# EAGLE design SMART4RGB (EAGLE 9.6.2)
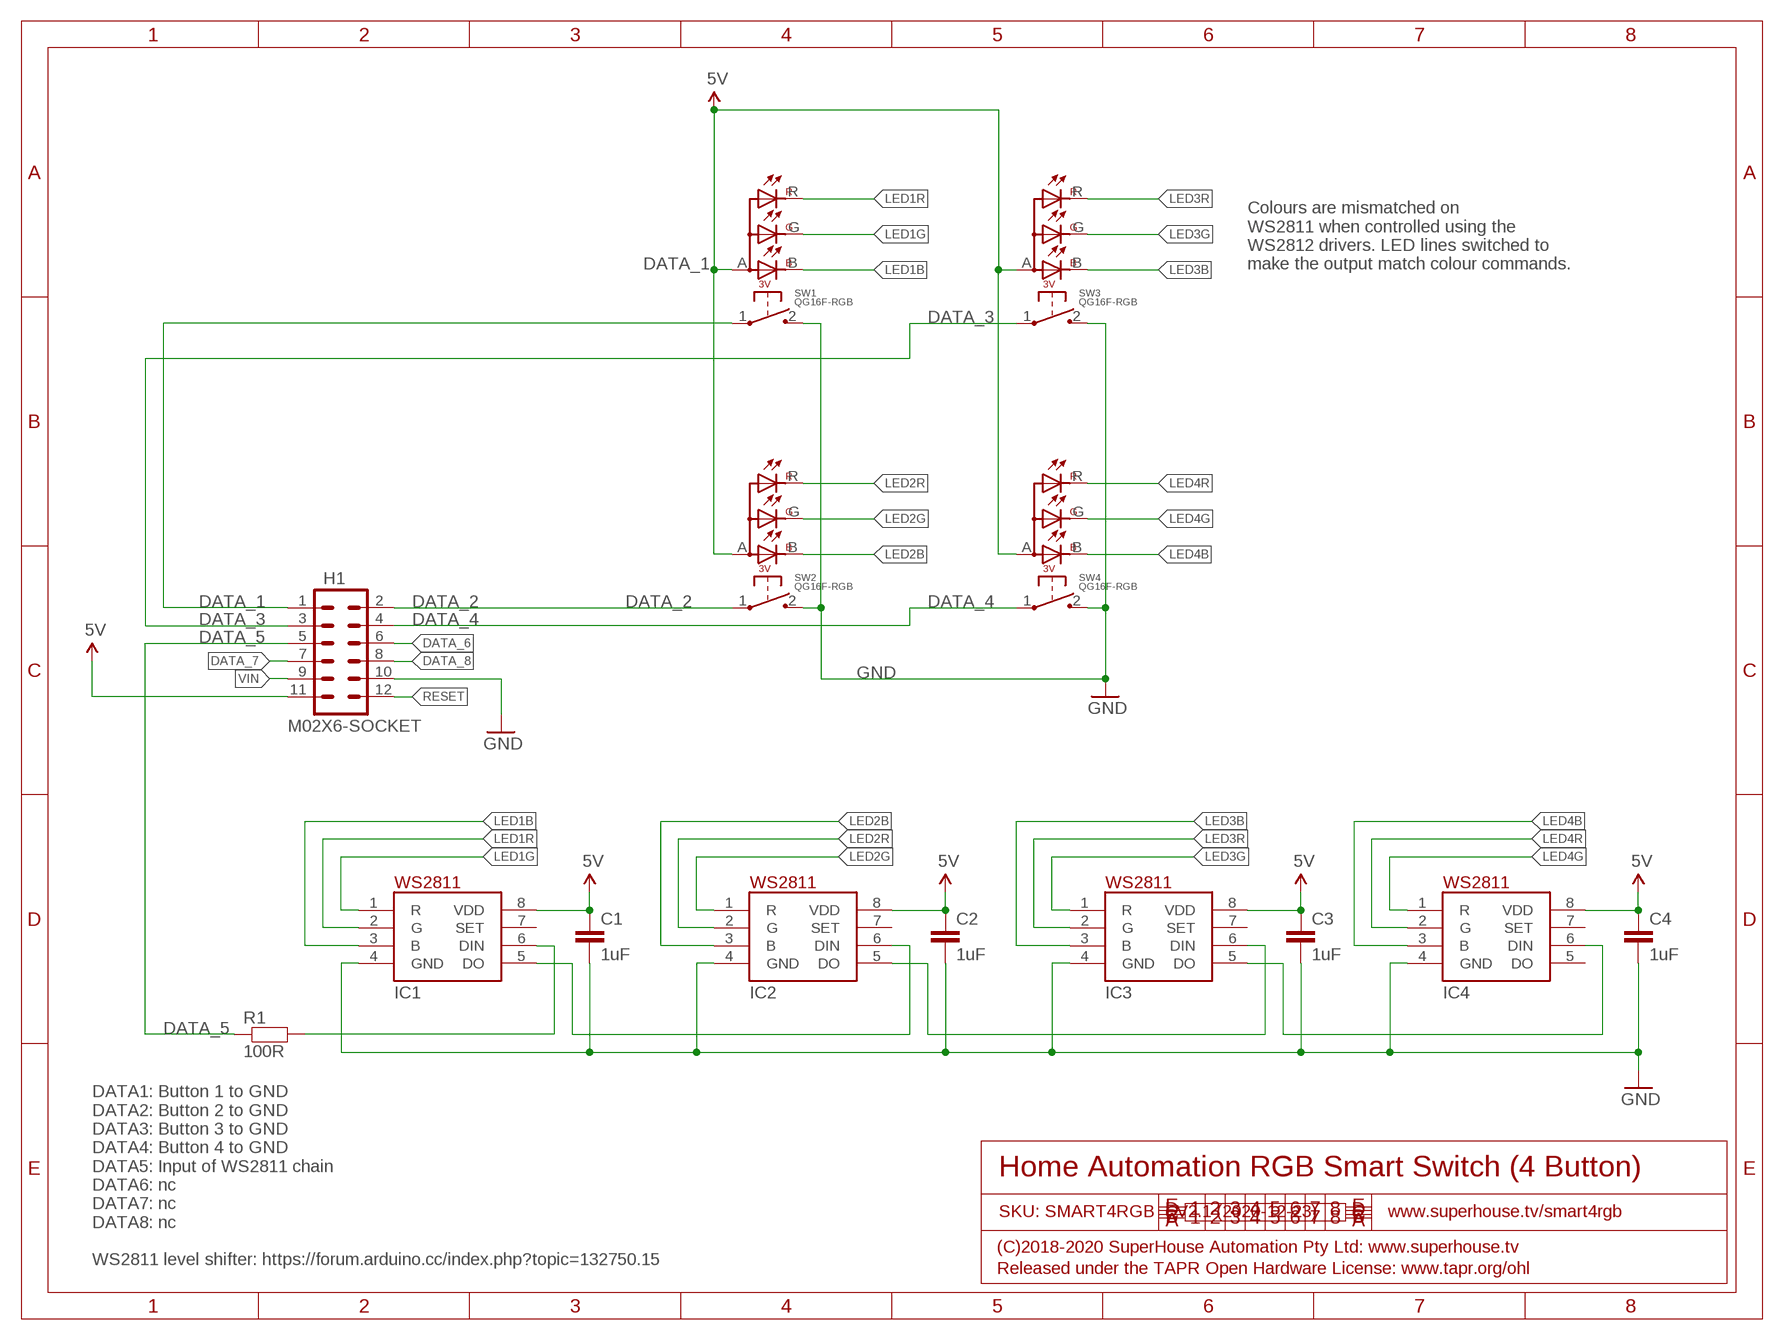
[diagram p0: schematic, sheet 1]

## Parts
C1  1uF  CAP0603  [C0603]
C2  1uF  CAP0603  [C0603]
C3  1uF  CAP0603  [C0603]
C4  1uF  CAP0603  [C0603]
H1  M02X6-SOCKET  [2X06-S]
IC1  WS2811-SOP8  [SO08-SKINNYPADS]
IC2  WS2811-SOP8  [SO08-SKINNYPADS]
IC3  WS2811-SOP8  [SO08-SKINNYPADS]
IC4  WS2811-SOP8  [SO08-SKINNYPADS]
R1  100R  RESISTOR0603  [R0603]
SW1  QG16F-RGB  [QG16F-RGB]
SW2  QG16F-RGB  [QG16F-RGB]
SW3  QG16F-RGB  [QG16F-RGB]
SW4  QG16F-RGB  [QG16F-RGB]

## Nets
5V: C1.1 C2.1 C3.1 C4.1 H1.11 IC1.8(VDD) IC2.8(VDD) IC3.8(VDD) IC4.8(VDD) SW1.A(+) SW2.A(+) SW3.A(+) SW4.A(+)
DATA_1: H1.1 SW1.1
DATA_2: H1.2 SW2.1
DATA_3: H1.3 SW3.1
DATA_4: H1.4 SW4.1
DATA_5: H1.5 R1.1
DATA_6: H1.6
DATA_7: H1.7
DATA_8: H1.8
GND: C1.2 C2.2 C3.2 C4.2 H1.10 IC1.4(GND) IC2.4(GND) IC3.4(GND) IC4.4(GND) SW1.2 SW2.2 SW3.2 SW4.2
LED1B: IC1.3(B) SW1.B
LED1G: IC1.1(R) SW1.G
LED1R: IC1.2(G) SW1.R
LED2B: IC2.3(B) SW2.B
LED2G: IC2.1(R) SW2.G
LED2R: IC2.2(G) SW2.R
LED3B: IC3.3(B) SW3.B
LED3G: IC3.1(R) SW3.G
LED3R: IC3.2(G) SW3.R
LED4B: IC4.3(B) SW4.B
LED4G: IC4.1(R) SW4.G
LED4R: IC4.2(G) SW4.R
N$1: IC1.6(DIN) R1.2
N$6: IC1.5(DO) IC2.6(DIN)
N$12: IC2.5(DO) IC3.6(DIN)
N$13: IC3.5(DO) IC4.6(DIN)
RESET: H1.12
VIN: H1.9
Unconnected: IC1.7(SET) IC2.7(SET) IC3.7(SET) IC4.5(DO) IC4.7(SET)

## Notes on the sheet
- Colours are mismatched on
  WS2811 when controlled using the
  WS2812 drivers. LED lines switched to
  make the output match colour commands.
- Home Automation RGB Smart Switch (4 Button)
- SKU: SMART4RGB | V2.1 (2020-12-23) | www.superhouse.tv/smart4rgb
- (C)2018-2020 SuperHouse Automation Pty Ltd: www.superhouse.tv
- DATA1: Button 1 to GND
  DATA2: Button 2 to GND
  DATA3: Button 3 to GND
  DATA4: Button 4 to GND
  DATA5: Input of WS2811 chain
  DATA6: nc
  DATA7: nc
  DATA8: nc
  
  WS2811 level shifter: https://forum.arduino.cc/index.php?topic=132750.15
- Released under the TAPR Open Hardware License: www.tapr.org/ohl

## Library data of the parts
C1-C4 = SuperHouse-DiscreteSemi:CAP: Capacitor Standard ceramic capacitor
H1 = SuperHouse-Connectors:M02X6: M12 header in 2x6 format
IC1-IC4 = SuperHouse-ICs:WS2811: WS2811 LED driver
R1 = SuperHouse-DiscreteSemi:RESISTOR: Resistors in both surface-mount and through-hole versions.
SW1-SW4 = SuperHouse-Switches:QG16F-RGB: RGB illuminated chrome bezel button

## Net classes
0 Default: width 0.203 mm
1 VCC: width 0.305 mm

## Board
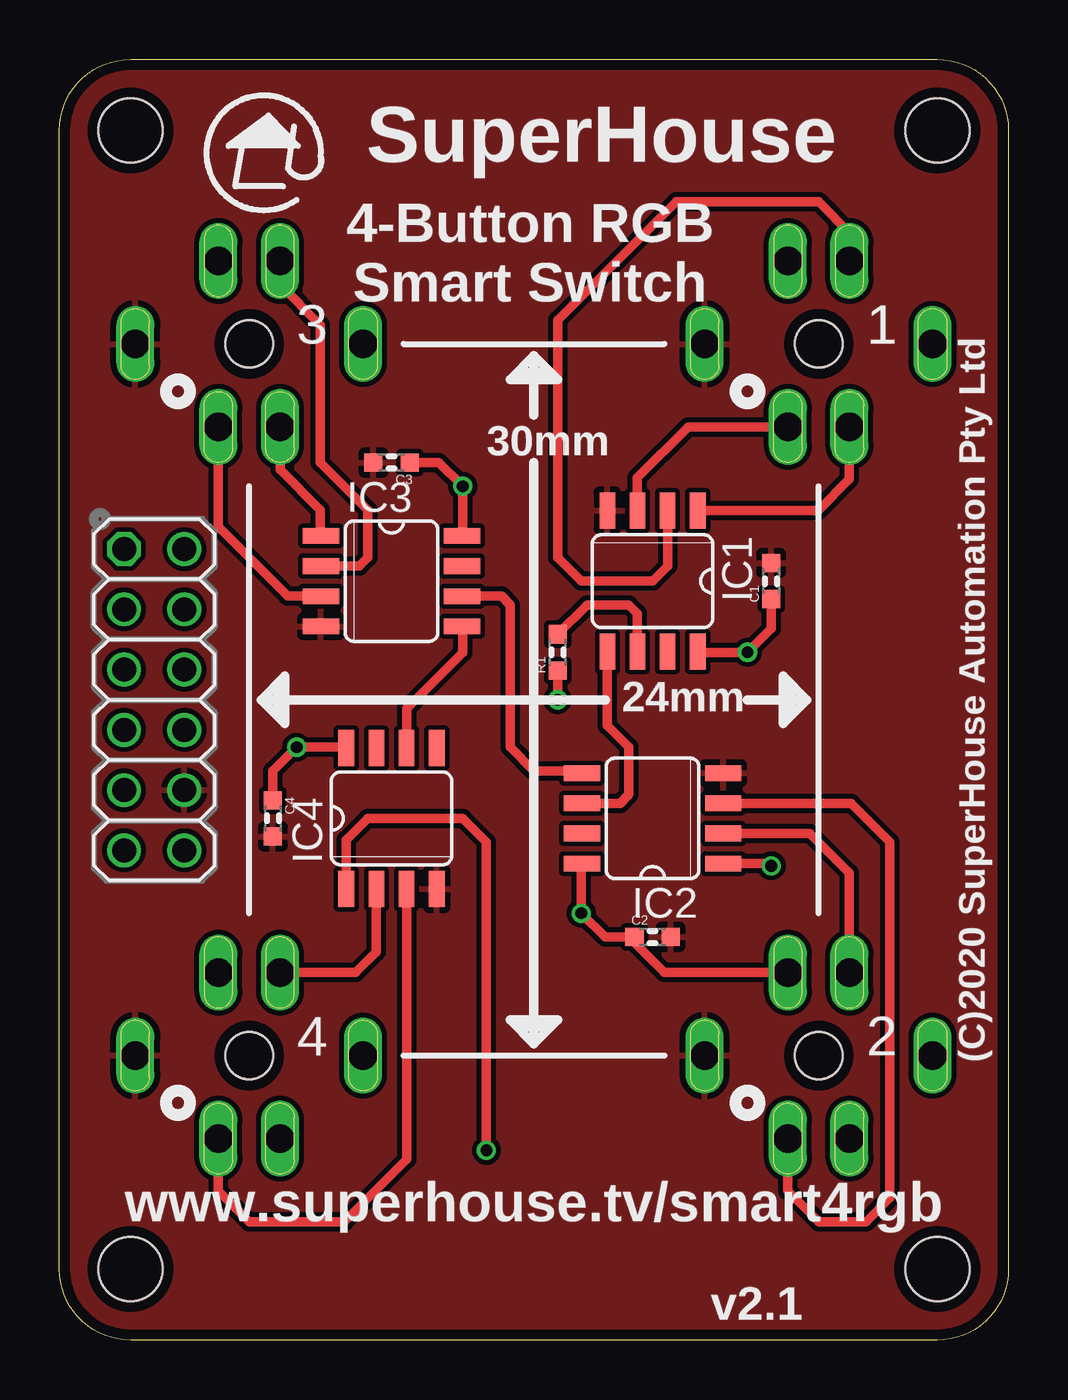
[diagram p1: board, top side]
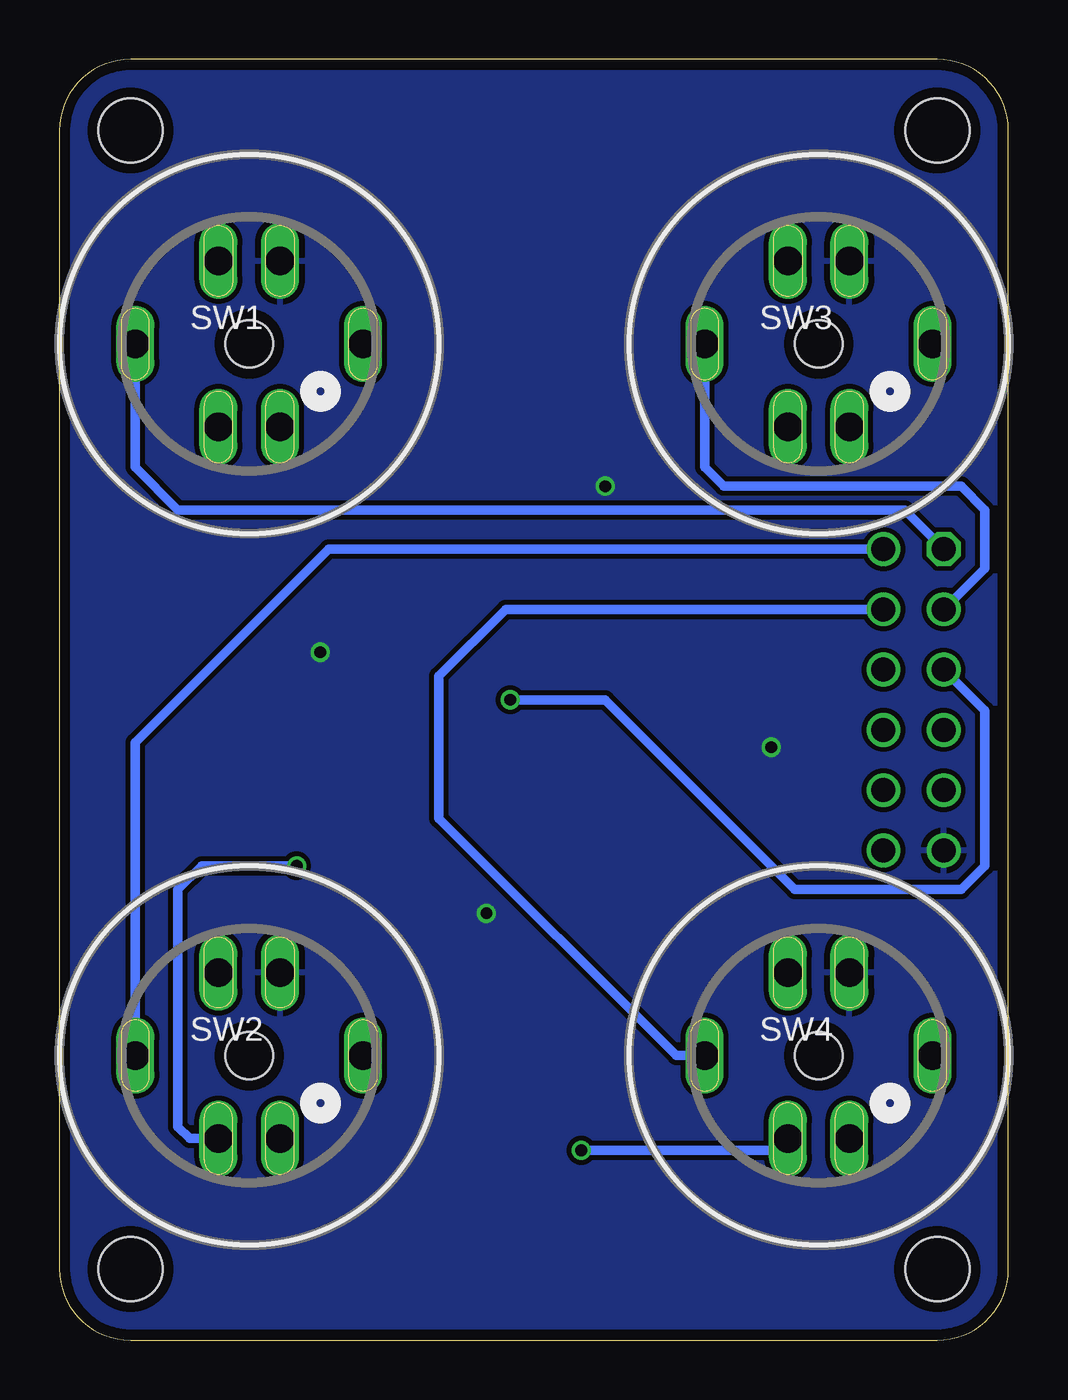
[diagram p2: board, bottom side, seen from below]

Size 40 x 54 mm. Coordinates in mm from the lower left corner, seen from the top.
Outline: 37,0 3,0 arc-90 0,3 0,51 arc-90 3,54 37,54 arc-90 40,51 40,3 arc-90 37,0
Copper layers (1*16): Top 0.035mm / dielectric 1.5mm / Bottom 0.035mm
Design rules "default *": minimum track width 8mil, minimum drill 15mil, track to track 8mil, track to pad 8mil, pad to pad 8mil, via to via 8mil, smd to smd 8mil, copper to edge 18mil, drill to drill 8mil, minimum pad ring 8mil, minimum via ring 6mil, stop-mask expansion 4mil, vias tented up to drill 25mil, thermal gap 10mil
Holes 2 mm at 8,12 32,12 32,42 8,42
Holes 2.7 mm at 3,3 3,51 37,51 37,3

### Footprints (pad centres in the part's own frame; a part is rotated, then mirrored left to right if it is on the bottom)
C0603 = smd 0.762 x 0.762: 1 -0.762,0; 2 0.762,0
2X06-S = drill 1.016 octagon: 1 -6.35,-1.27 | drill 1.016: 2 -6.35,1.27; 3 -3.81,-1.27; 4 -3.81,1.27; 5 -1.27,-1.27; 6 -1.27,1.27; 7 1.27,-1.27; 8 1.27,1.27; 9 3.81,-1.27; 10 3.81,1.27; 11 6.35,-1.27; 12 6.35,1.27
SO08-SKINNYPADS = smd 0.66 x 1.524: 1 -1.905,-2.973; 2 -0.635,-2.973; 3 0.635,-2.973; 4 1.905,-2.973; 5 1.905,2.973; 6 0.635,2.973; 7 -0.635,2.973; 8 -1.905,2.973
R0603 = smd 0.762 x 0.762: 1 -0.762,0; 2 0.762,0
QG16F-RGB = drill 1.2 long: 1 -4.8,0; 2 4.8,0; A 1.3,3.5; B 1.3,-3.5; G -1.3,-3.5; R -1.3,3.5

### Placement (x,y rotation side)
C1  30,32 90 top
C2  25,17 0 top
C3  14,37 180 top
C4  9,22 270 top
H1  4,27 270 top
IC1  25,32 180 top
IC2  25,22 90 top
IC3  14,32 270 top
IC4  14,22 0 top
R1  21,29 90 top
SW1  32,42 0 bottom
SW2  32,12 0 bottom
SW3  8,42 0 bottom
SW4  8,12 0 bottom

### Tracks (layer width: path | path; a pad name or v marks a point on that pad's centre or on a via)
5V  (via drill 0.5)
  Top 0.406: SW2.A 25.5,15.5 24.24,16.76 C2.1 23,17 v22,18 22,20.07 IC2.8 | C3.1 16,37 v17,36 17,33.93 IC3.8 | C1.1 30,30 v29,29 26.93,29 IC1.8 | C4.1 9,24 v10,25 12.07,25 IC4.8
  pour Bottom: 37,54 3,54 arc90 0,51 0,3 arc90 3,0 37,0 arc90 40,3 40,51 arc90
DATA_1
  Bottom 0.406: SW1.1 36.8,36.8 35,35 4.38,35 H1.1
DATA_2
  Bottom 0.406: SW2.1 36.8,25.2 28.65,33.35 H1.2
DATA_3
  Bottom 0.406: SW3.1 12.8,36.8 12,36 2,36 1,35 1,32.54 H1.3
DATA_4
  Bottom 0.406: SW4.1 14,12 24,22 24,28 21.19,30.81 H1.4
DATA_5  (via drill 0.5)
  Top 0.406: R1.1 v21,27
  Bottom 0.406: v21,27 17,27 9,19 2,19 1,20 1,26.54 H1.5
GND
  pour Top: 37,54 3,54 arc90 0,51 0,3 arc90 3,0 37,0 arc90 40,3 40,51 arc90
LED1B
  Top 0.406: IC1.3 24.36,36.37 26.5,38.5 SW1.B
LED1G
  Top 0.406: IC1.1 31.97,34.97 33.3,36.3 SW1.G
LED1R
  Top 0.406: IC1.2 25.64,32.63 25,32 22,32 21,33 21,43 26,48 32,48 33.3,46.7 SW1.R
LED2B
  Top 0.406: SW2.B 30.7,6.3 32,5 34,5 35,6 35,21 33.37,22.64 IC2.3
LED2G  (via drill 0.5)
  Top 0.406: IC2.1 29.91,20.09 v30,20
  Bottom 0.406: v30,20 34,20 35,19 35,9 34.5,8.5 SW2.G
LED2R
  Top 0.406: IC2.2 31.64,21.36 33.3,19.7 SW2.R
LED3B
  Top 0.406: IC3.3 9.63,31.36 6.7,34.3 SW3.B
LED3G
  Top 0.406: IC3.1 11,33.93 11,35 9.3,36.7 SW3.G
LED3R
  Top 0.406: SW3.R 9.3,44.5 11,42.8 11,37 13,35 13,33 12.63,32.63 IC3.2
LED4B
  Top 0.406: SW4.B 6.7,6.3 8,5 12,5 14.63,7.63 IC4.3
LED4G  (via drill 0.5)
  Top 0.406: IC4.1 12.1,21.09 13,22 17,22 18,21 v18,8
  Bottom 0.406: SW4.G 9.8,8 v18,8
LED4R
  Top 0.406: IC4.2 13.37,16.36 12.5,15.5 SW4.R
N$1
  Top 0.406: R1.2 22.24,31 24,31 24.36,30.64 IC1.6
N$6
  Top 0.406: IC1.5 23.09,25.91 24,25 24,23 23.64,22.64 IC2.6
N$12
  Top 0.406: IC2.5 21.93,24 20,24 19,25 19,31 18.64,31.36 IC3.6
N$13
  Top 0.406: IC4.6 14.63,26.64 17,29 17,30.07 IC3.5

### Text on the board
tPlace: SuperHouse | 4-Button RGB / Smart Switch | 3 | 1 | 30mm | (C)2020 SuperHouse Automation Pty Ltd | 24mm | 4 | 2 | www.superhouse.tv/smart4rgb | v2.1